# EAGLE design ENERGIS_FPC-1.0.0 (EAGLE 9.2.1)
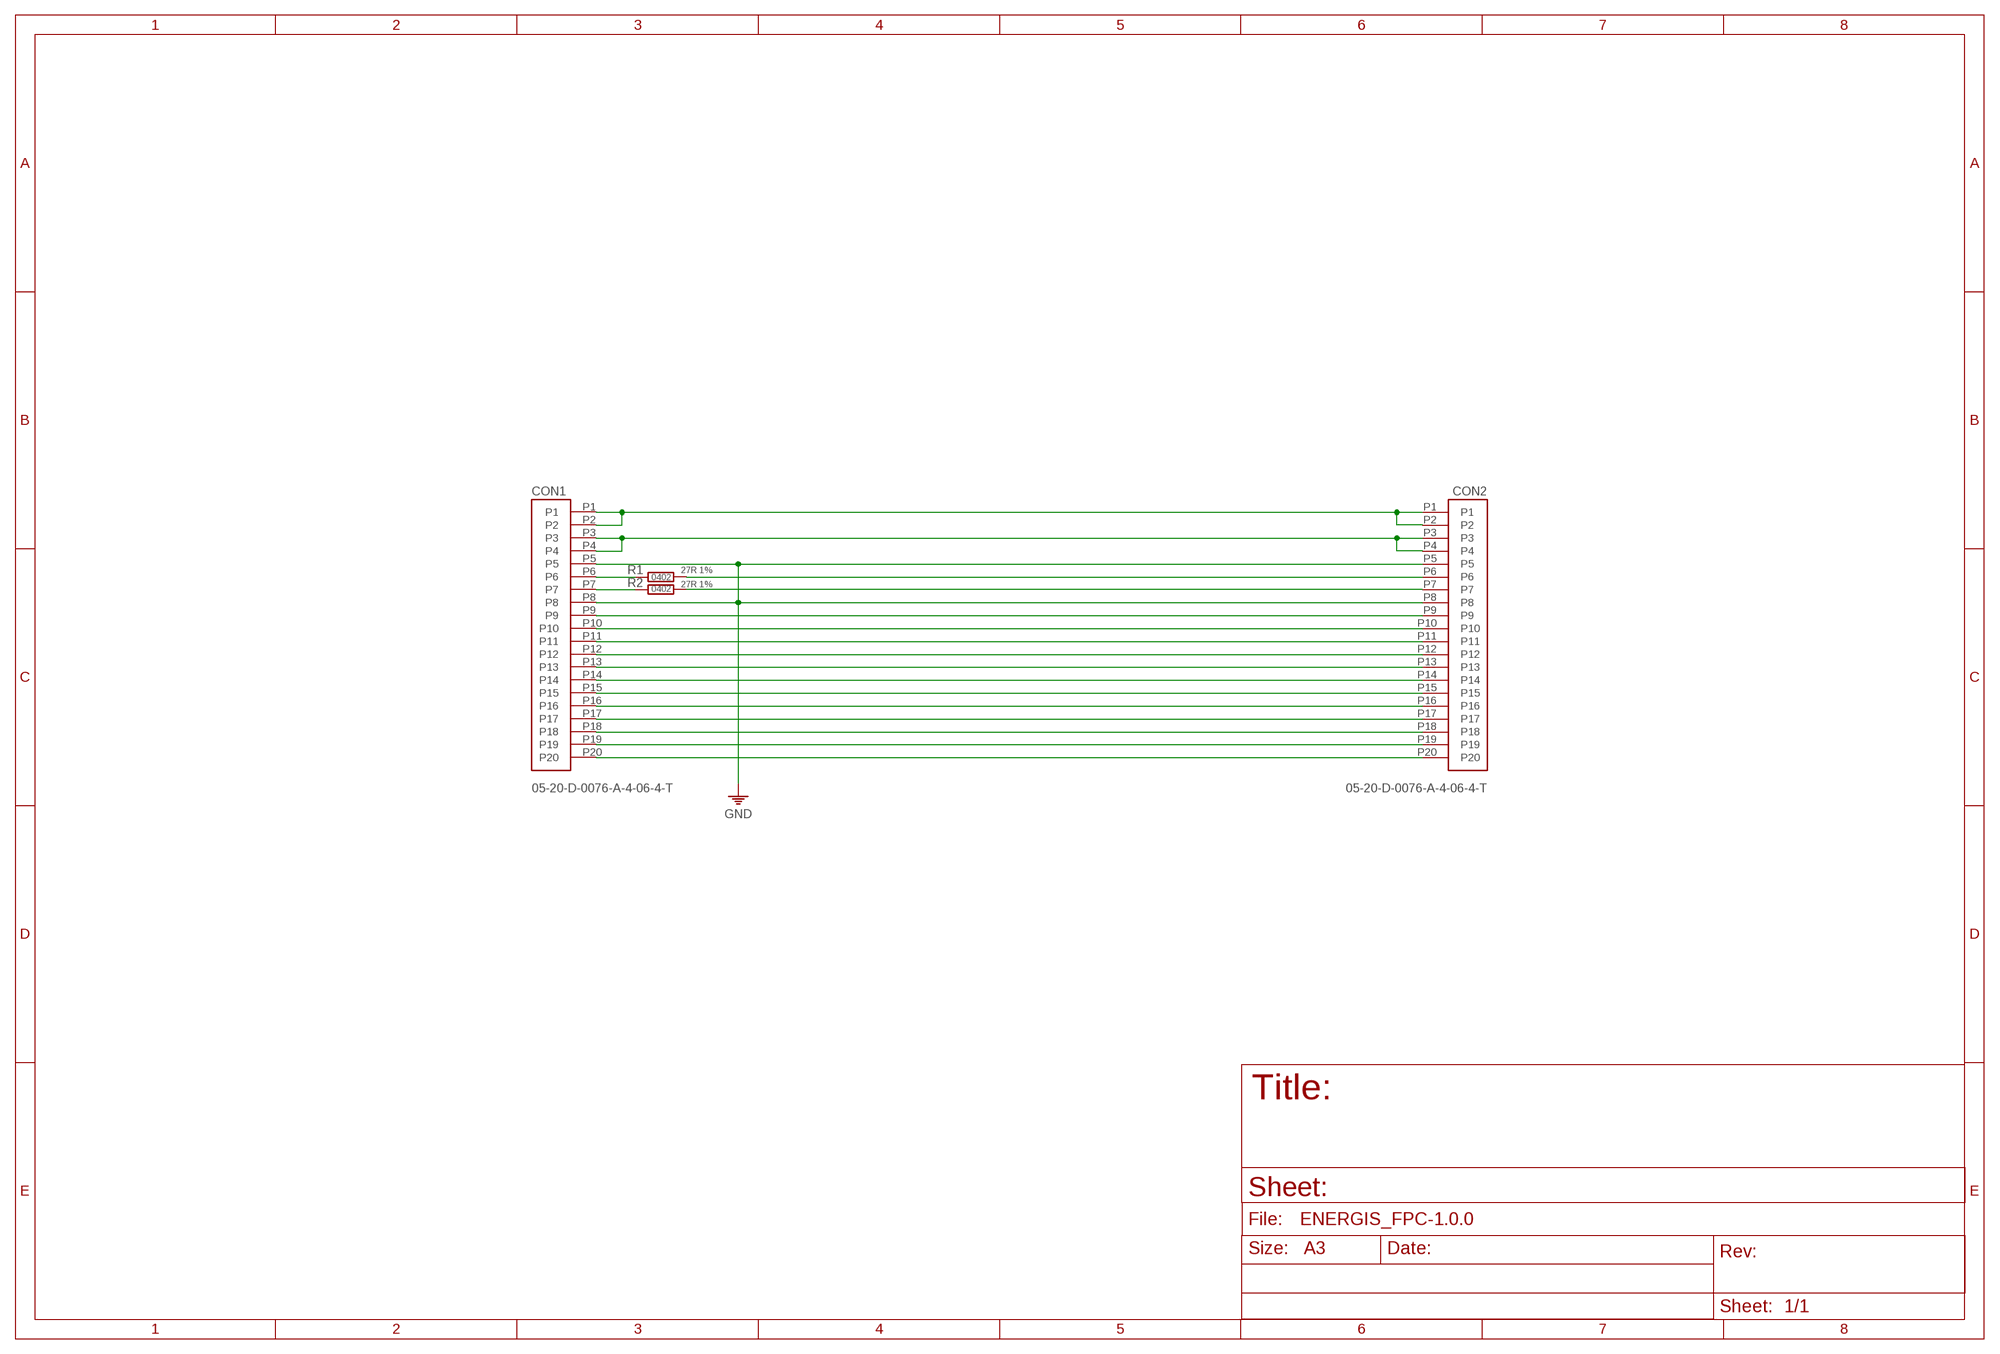
[diagram p0: schematic, sheet 1]

## Parts
CON1  05-20-D-0076-A-4-06-4-T  [05-20-D-0076-A-4-06-4-T]
CON2  05-20-D-0076-A-4-06-4-T  [05-20-D-0076-A-4-06-4-T]
R1  27R 1%  27R-1%0402  [0402]
R2  27R 1%  27R-1%0402  [0402]

## Nets
GND: CON1.P5 CON1.P8 CON2.P5 CON2.P8
N$1: CON1.P1 CON1.P2 CON2.P1 CON2.P2
N$3: CON1.P3 CON1.P4 CON2.P3 CON2.P4
N$6: CON1.P6 R1.1
N$7: CON1.P7 R2.1
N$9: CON1.P9 CON2.P9
N$10: CON1.P10 CON2.P10
N$11: CON1.P11 CON2.P11
N$12: CON1.P12 CON2.P12
N$13: CON1.P13 CON2.P13
N$14: CON1.P14 CON2.P14
N$15: CON1.P15 CON2.P15
N$16: CON1.P16 CON2.P16
N$17: CON1.P17 CON2.P17
N$18: CON1.P18 CON2.P18
N$19: CON1.P19 CON2.P19
N$20: CON1.P20 CON2.P20
N$21: CON2.P6 R1.2
N$22: CON2.P7 R2.2

## Library data of the parts
CON1 CON2 = ds_con:05-20-D-0076-A-4-06-4-T
R1 R2 = ds_resistor:27R-1%; DESCRIPTION: 62.5mW Thick Film Resistors 50V ±100ppm/℃ ±1% 27Ω 0402 Chip Resistor - Surface Mount ROHS; LCSC_PART: C138021; PACKAGE: 0402

## Net classes
0 50R_SE: width 0.148 mm, drill 0.2 mm, clearance 0.163 mm

## Board
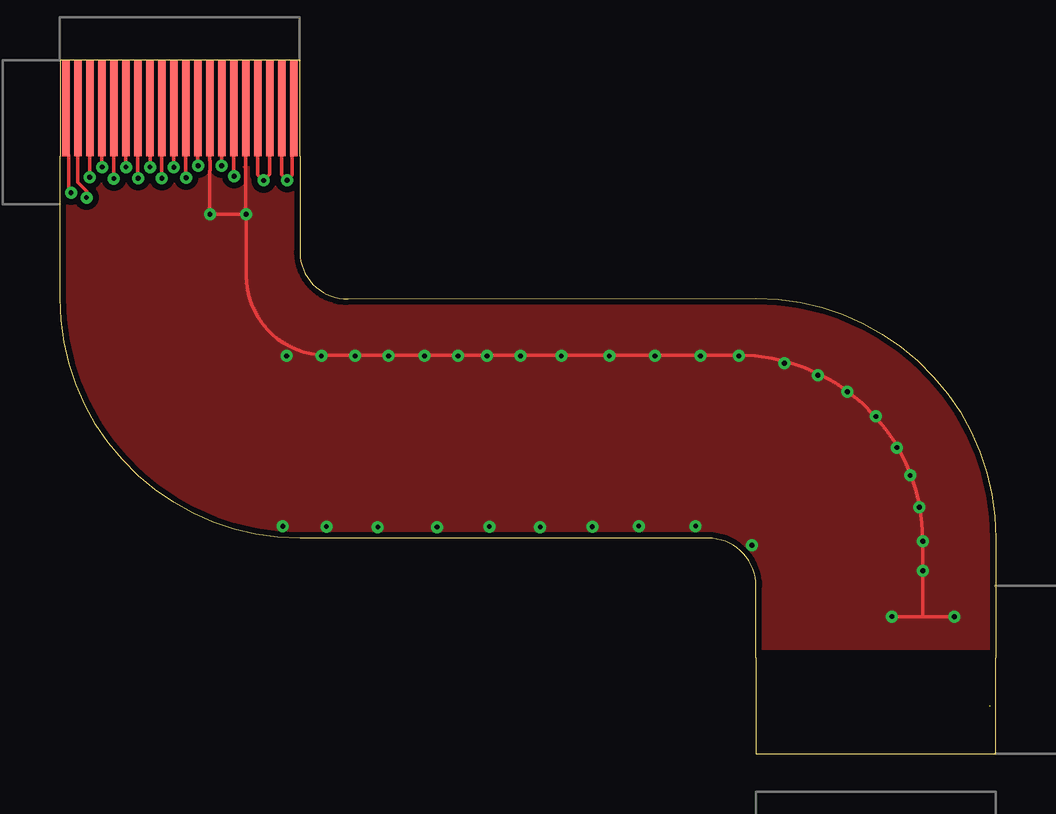
[diagram p1: board, top side]
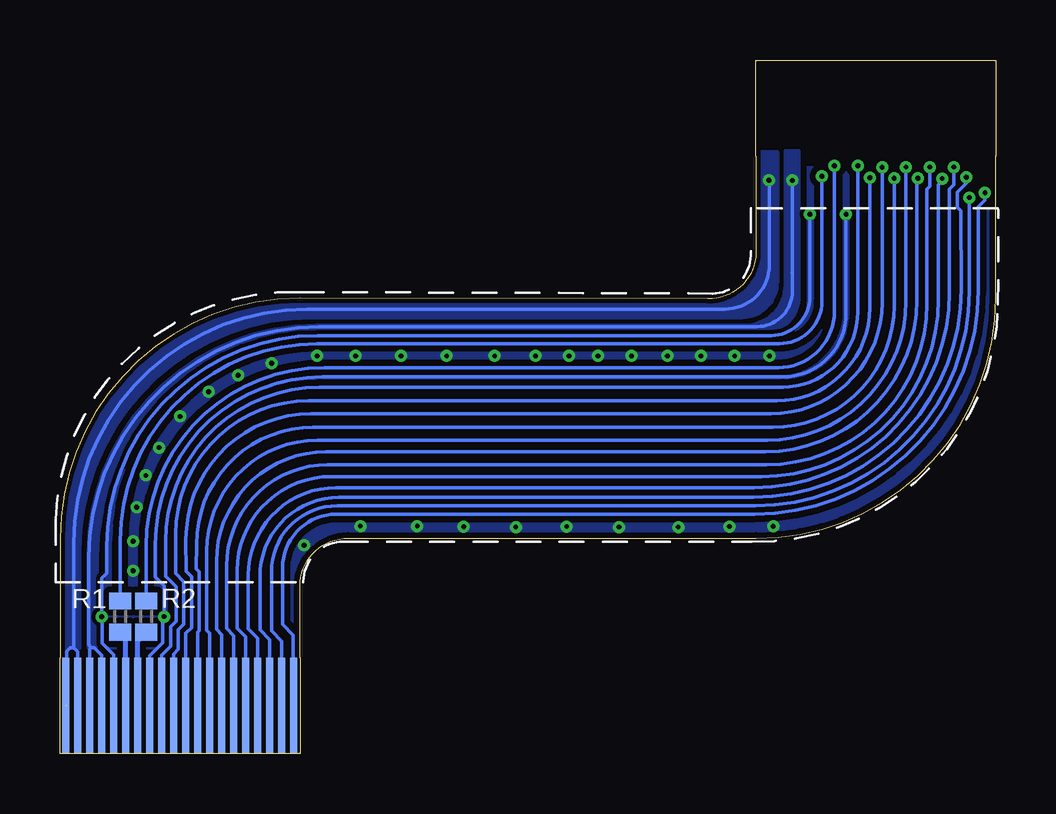
[diagram p2: board, bottom side, seen from below]

Size 39.02 x 28.91 mm. Coordinates in mm from the lower left corner, seen from the top.
Outline: 39.02,8 39.02,4 39.02,0 29.02,0 29.02,4 29.02,6.98 arc90 27.02,8.98 10,8.98 arc-90 0,18.98 0,20.91 0,24.91 0,28.91 10,28.91 10,24.91 10,20.91 10,20.87 arc90 12,18.96 29.02,18.98 arc-90 39.02,8.98 39.02,8
Copper layers (1*16): Top 0.012mm / dielectric 0.025mm / Bottom 0.012mm
Design rules "JLC04161H-3313_4-layer_1.6mm-SE-ONLY-minimum *": minimum track width 3.5mil, minimum drill 0.15mm, track to track 3.5mil, track to pad 3.5mil, pad to pad 3.5mil, via to via 3.5mil, smd to smd 3.5mil, copper to edge 0.2mm, drill to drill 6mil, minimum pad ring 8mil, minimum via ring 0.15mm, stop-mask expansion 0.05mm, vias tented up to drill 16mil, thermal gap 10mil

### Footprints (pad centres in the part's own frame; a part is rotated, then mirrored left to right if it is on the bottom)
05-20-D-0076-A-4-06-4-T = smd 4 x 0.3: P1 0,4.5; P2 0,4; P3 0,3.5; P4 0,3; P5 0,2.5; P6 0,2; P7 0,1.5; P8 0,1; P9 0,0.5; P10 0,0; P11 0,-0.5; P12 0,-1; P13 0,-1.5; P14 0,-2; P15 0,-2.5; P16 0,-3; P17 0,-3.5; P18 0,-4; P19 0,-4.5; P20 0,-5
0402 = smd 0.7 x 0.9: 1 -0.65,0; 2 0.65,0

### Placement (x,y rotation side)
CON1  34.28,2.01 90 bottom
CON2  5.25,26.91 270 top
R1  36.51,5.72 90 bottom
R2  35.43,5.72 90 bottom

### Tracks (layer width: path | path; a pad name or v marks a point on that pad's centre or on a via)
GND  (via drill 0.2)
  Top 0.15: v34.68,5.72 35.97,5.72 | v37.28,5.71 v37.27,5.72 35.97,5.72 | 35.97,5.72 v35.97,7.63 35.97,8.9 arc90 28.26,16.61 11.09,16.61 arc-90 7.76,19.94 7.76,22.41 | CON2.P5 v7.75,22.49 v7.76,22.48 7.76,22.41 | 7.76,22.41 7.76,21.94 | CON2.P8 6.25,24.72 6.25,24.71 6.25,24.31 v6.25,22.48 7.69,22.48 7.76,22.41
  Bottom 0.15: CON1.P5 36.78,4.13 37.27,4.62 37.27,5.7 v37.28,5.71 37.28,7.32 37.07,7.53 37.07,8.64 arc90 28.28,17.43 9.37,17.43 arc-90 7.76,19.04 v7.76,22.48 | CON1.P8 35.28,4.09 34.73,4.63 34.73,5.67 v34.68,5.72 34.68,7 35.05,7.37 35.05,8.74 arc90 28.08,15.71 8.88,15.71 arc-90 6.25,18.34 v6.25,22.48
  other vias: 35.97,8.86 35.82,10.27 35.44,11.6 34.89,12.76 34.01,14.06 32.83,15.09 10.9,16.58 9.45,16.58 12.3,16.58 13.7,16.58 15.2,16.58 16.6,16.58 17.8,16.58 19.2,16.58 20.9,16.58 22.9,16.58 24.8,16.58 26.7,16.58 28.3,16.58 30.2,16.28 31.6,15.78 28.84,8.69 26.5,9.49 24.13,9.49 22.19,9.46 20.02,9.45 17.9,9.47 15.72,9.45 13.25,9.45 11.11,9.47 9.29,9.48
  pour Bottom (isolate 0.254, rank 6): -0.65,24.45 39.85,24.45 39.85,4.4 -0.65,4.4
  pour Top (isolate 0.254, rank 6): -1.15,24.45 40.35,24.45 40.35,4.38 -1.15,4.38
N$1  (via drill 0.2)  (1 unrouted)
  Top 0.15: v9.47,23.9 9.67,24.1 9.67,26.21 | 9.72,26.91 9.72,26.89 9.67,26.83 9.67,26.21 | CON2.P1 9.75,26.29 9.67,26.21
  Top 0.152: CON2.P2 9.25,24.12 v9.47,23.9
  Bottom 0.148: 38.45,4.43 38.45,8.8 arc90 28.72,18.53 11.3,18.53 arc-90 9.45,20.38 9.45,23.88 v9.47,23.9
  Bottom 0.152: CON1.P2 38.28,4.26 38.45,4.43 38.6,4.43 38.74,4.29 38.74,2.01
  pour Bottom (isolate 0.15): 38.2,4.39 39.09,4.39 39.15,4.45 39.15,8.88 arc90 29.05,18.98 11.7,18.98 arc-90 10.14,20.54 10.14,25.08 9.12,25.08 9.12,19.65 arc90 10.59,18.18 28.48,18.18 arc-90 38.2,8.46
N$3  (via drill 0.2)
  Top 0.15: CON2.P3 8.74,24.14 v8.49,23.89
  Top 0.152: CON2.P4 8.25,24.13 v8.49,23.89
  Bottom 0.148: v8.49,23.89 8.49,20.05 | 8.49,20.05 8.52,20.05 | 8.49,20.05 8.49,19.28 arc90 9.97,17.8 28.21,17.8 arc-90 37.82,8.19 37.82,4.59 arc-90 37.65,4.42
  Bottom 0.15: CON1.P3 37.78,3.89 37.8,3.91
  Bottom 0.152: CON1.P4 37.28,4.11 37.59,4.42 37.65,4.42 37.72,4.42 37.78,4.36 CON1.P3
  pour Bottom (isolate 0.15): 37.46,4.43 37.84,4.43 37.84,8.36 arc90 28.33,17.86 10.46,17.86 arc-90 8.79,19.53 8.79,25.12 8.22,25.12 8.22,19.07 arc90 9.8,17.49 28.17,17.49 arc-90 37.46,8.2
N$6
  Bottom 0.2: CON1.P6 36.28,4.84 R1.1
N$7
  Bottom 0.2: CON1.P7 35.78,4.72 R2.1
N$9  (via drill 0.2)
  Top 0.15: CON2.P9 5.75,24.53 v5.76,24.51
  Bottom 0.15: CON1.P9 34.78,4.11 34.41,4.48 34.41,5.3 34.18,5.53 34.18,6.96 34.62,7.4 34.62,8.86 arc90 28.19,15.28 8.89,15.28 arc-90 5.76,18.41 5.76,21.54 5.77,21.54 5.77,21.94 5.76,21.95 v5.76,24.51
N$10  (via drill 0.2)
  Top 0.15: CON2.P10 v5.25,24.01 v5.26,24
  Bottom 0.15: CON1.P10 34.28,4.16 34.08,4.35 34.08,5.17 33.86,5.4 33.86,7.18 34.2,7.52 34.19,9.17 arc90 28.65,14.71 9.14,14.71 arc-90 5.26,18.59 v5.26,24
N$11  (via drill 0.2)
  Top 0.15: CON2.P11 v4.75,24.44
  Bottom 0.15: CON1.P11 33.78,4.22 33.77,4.22 33.77,5.03 33.54,5.26 33.54,7.38 33.77,7.61 33.77,8.95 arc90 28.55,14.17 9.39,14.17 arc-90 4.75,18.81 v4.75,24.44
N$12  (via drill 0.2)
  Top 0.15: CON2.P12 v4.25,23.98
  Bottom 0.15: CON1.P12 33.28,5.07 33.22,5.13 33.22,7.59 33.34,7.71 33.33,8.74 arc90 28.46,13.61 9.31,13.61 arc-90 4.25,18.67 v4.25,23.98
N$13  (via drill 0.2)
  Top 0.15: CON2.P13 v3.75,24.45
  Bottom 0.15: CON1.P13 32.78,5.03 32.9,5.15 32.9,8.46 arc90 28.28,13.07 9.53,13.07 arc-90 3.75,18.86 v3.75,24.45
N$14  (via drill 0.2)
  Top 0.15: CON2.P14 v3.25,23.99 v3.26,23.98
  Bottom 0.15: CON1.P14 32.28,4.97 32.5,5.19 32.5,8.02 arc90 27.92,12.59 9.61,12.59 arc-90 3.3,18.91 3.3,23.94 v3.26,23.98
N$15  (via drill 0.2)
  Top 0.15: CON2.P15 v2.75,24.46 v2.75,24.45
  Bottom 0.15: CON1.P15 31.78,4.93 32.07,5.23 32.07,7.83 arc90 27.86,12.05 9.58,12.05 arc-90 2.87,18.75 2.87,23.52 2.75,23.65 v2.75,24.45
N$16  (via drill 0.2)
  Top 0.15: CON2.P16 v2.25,23.97
  Bottom 0.15: CON1.P16 31.28,4.87 31.63,5.23 31.63,7.63 arc90 27.71,11.56 9.78,11.56 arc-90 2.4,18.94 2.4,23.72 2.25,23.87 v2.25,23.97
N$17  (via drill 0.2)
  Top 0.15: CON2.P17 v1.75,24.46 v1.76,24.45
  Bottom 0.15: CON1.P17 30.78,4.82 31.17,5.21 31.17,7.44 arc90 27.51,11.09 10.1,11.09 arc-90 1.94,19.25 1.94,23.53 1.76,23.72 v1.76,24.45
N$18  (via drill 0.2)
  Top 0.15: CON2.P18 1.25,24.03 v1.24,24.02
  Bottom 0.15: CON1.P18 30.28,4.76 30.68,5.17 30.68,7.39 arc90 27.38,10.69 10.12,10.69 arc-90 1.45,19.36 1.47,22.63 1.62,22.78 1.62,23.39 1.51,23.5 1.24,23.77 v1.24,24.02
N$19  (via drill 0.2)
  Top 0.15: CON2.P19 0.75,23.81 1.11,23.45 v1.11,23.18
  Bottom 0.15: CON1.P19 29.78,4.7 30.2,5.13 30.2,7.59 arc90 27.46,10.34 10.03,10.34 arc-90 1.12,19.25 v1.12,23.17 v1.11,23.18
N$20  (via drill 0.2)
  Top 0.15: CON2.P20 0.25,25.06 0.36,24.95 0.36,23.48 v0.46,23.38
  Bottom 0.15: CON1.P20 29.28,3.93 29.3,3.95 29.3,4.95 29.74,5.4 29.74,7.75 arc90 27.5,9.98 10.07,9.98 arc-90 0.73,19.33 0.73,22.79 0.46,23.06 v0.46,23.38
N$21  (via drill 0.2)
  Top 0.15: CON2.P6 7.25,24.08 v7.26,24.07
  Bottom 0.15: R1.2 36.51,8.89 arc90 28.3,17.09 9.03,17.09 arc-90 7.26,18.86 v7.26,24.07
N$22  (via drill 0.2)
  Top 0.15: CON2.P7 v6.74,24.51
  Bottom 0.15: R2.2 35.43,8.65 arc90 27.99,16.09 9.08,16.09 arc-90 6.74,18.43 v6.74,24.51

### Text on the board
tDocu: Stiffner, bottom side / - Thickness: / - 0.25mm Polyimide / - 0.2mm FR4 / Size: 6mm x 10mm x 0.5mm | EMI Shielding area | Flex PCB Specification: / - Substrate Type: 25um dielectric / - FPC thickness: 0.11mm / - Polyimide Stiffner: 0.25mm / - FR4 Stiffner: 0.2mm / - Total thickness at stiffner: approx 0.5mm / / Stackup: 2 Layers + EMI Shielding / - EMI Shield / - L1 SIG / - L2 SIG / - EMI Shield | Stiffner, top side / - Thickness: / - 0.25mm Polyimide / - 0.2mm FR4 / Size: 7mm x 10mm x 0.5mm